# EAGLE design Memory (EAGLE 9.6.1)
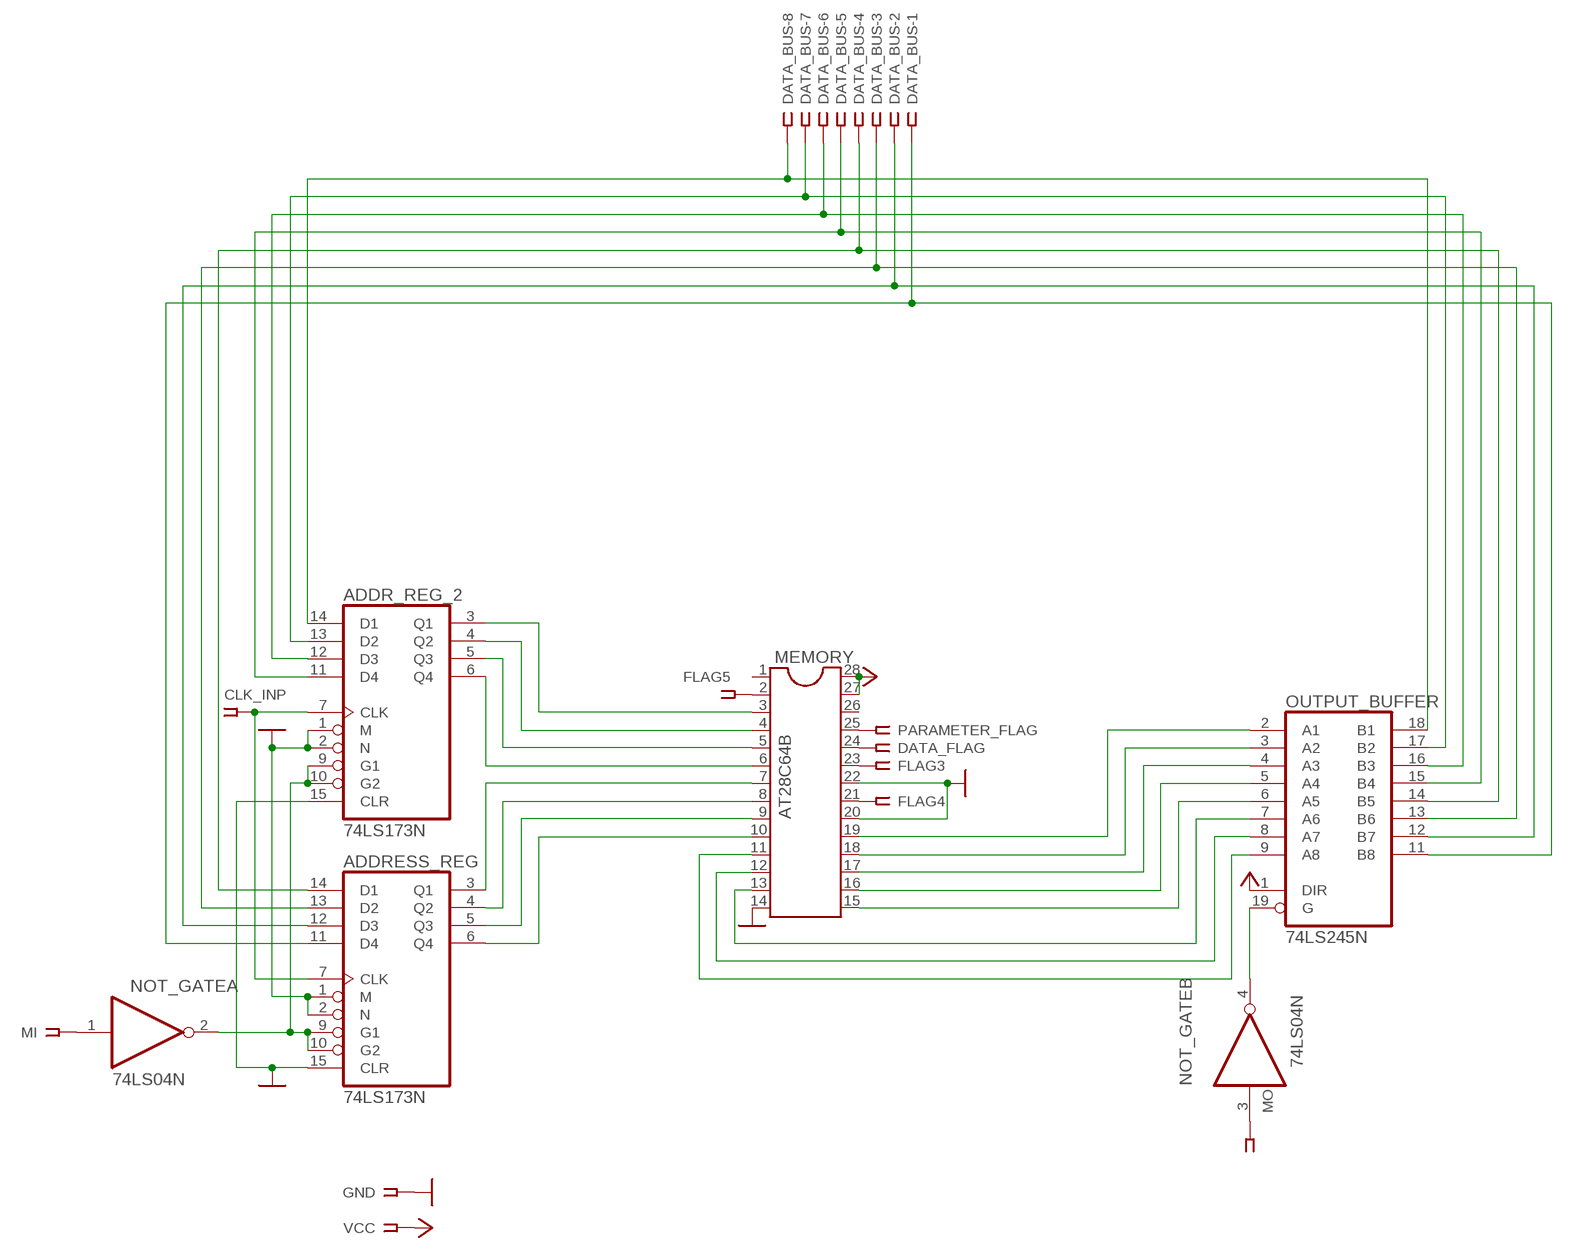
[diagram p0: schematic, sheet 1]

## Parts
ADDR_REG_2  74LS173N  [DIL16]
ADDRESS_REG  74LS173N  [DIL16]
CLK_INP  SSW-101-02-G-S-RA  [SSW-101-02-G-S-RA]
DATA_BUS  SSW-108-02-G-S  [SSW-108-02-G-S]
DATA_FLAG  SSW-101-02-G-S-RA  [SSW-101-02-G-S-RA]
FLAG3  SSW-101-02-G-S-RA  [SSW-101-02-G-S-RA]
FLAG4  SSW-101-02-G-S-RA  [SSW-101-02-G-S-RA]
FLAG5  SSW-101-02-G-S-RA  [SSW-101-02-G-S-RA]
GND  SSW-101-02-G-S-RA  [SSW-101-02-G-S-RA]
MEMORY  AT28C64B  DIL28  [DIL28-6]
MI  SSW-101-02-G-S-RA  [SSW-101-02-G-S-RA]
MO  SSW-101-02-G-S-RA  [SSW-101-02-G-S-RA]
NOT_GATE  74LS04N  [DIL14]
OUTPUT_BUFFER  74LS245N  [DIL20]
PARAMETER_FLAG  SSW-101-02-G-S-RA  [SSW-101-02-G-S-RA]
VCC  SSW-101-02-G-S-RA  [SSW-101-02-G-S-RA]

## Nets
GND: ADDR_REG_2.1(M) ADDR_REG_2.2(N) ADDR_REG_2.15(CLR) ADDRESS_REG.1(M) ADDRESS_REG.2(N) ADDRESS_REG.15(CLR) GND.1 MEMORY.14 MEMORY.20 MEMORY.22
N$1: ADDR_REG_2.7(CLK) ADDRESS_REG.7(CLK) CLK_INP.1
N$2: ADDR_REG_2.9(G1) ADDR_REG_2.10(G2) ADDRESS_REG.9(G1) ADDRESS_REG.10(G2) NOT_GATE.2(A:O)
N$3: MI.1 NOT_GATE.1(A:I)
N$4: ADDRESS_REG.6(Q4) MEMORY.10
N$5: ADDRESS_REG.5(Q3) MEMORY.9
N$6: ADDRESS_REG.4(Q2) MEMORY.8
N$7: ADDRESS_REG.3(Q1) MEMORY.7
N$8: ADDR_REG_2.6(Q4) MEMORY.6
N$9: FLAG5.1 MEMORY.2
N$10: FLAG3.1 MEMORY.23
N$11: DATA_FLAG.1 MEMORY.24
N$12: MEMORY.25 PARAMETER_FLAG.1
N$13: FLAG4.1 MEMORY.21
N$14: ADDR_REG_2.5(Q3) MEMORY.5
N$15: ADDR_REG_2.4(Q2) MEMORY.4
N$16: ADDR_REG_2.3(Q1) MEMORY.3
N$17: MEMORY.13 OUTPUT_BUFFER.7(A6)
N$18: MEMORY.12 OUTPUT_BUFFER.8(A7)
N$19: MEMORY.11 OUTPUT_BUFFER.9(A8)
N$20: MEMORY.15 OUTPUT_BUFFER.6(A5)
N$21: MEMORY.16 OUTPUT_BUFFER.5(A4)
N$22: MEMORY.17 OUTPUT_BUFFER.4(A3)
N$23: MEMORY.18 OUTPUT_BUFFER.3(A2)
N$24: MEMORY.19 OUTPUT_BUFFER.2(A1)
N$25: MO.1 NOT_GATE.3(B:I)
N$26: NOT_GATE.4(B:O) OUTPUT_BUFFER.19(G)
N$35: ADDR_REG_2.14(D1) DATA_BUS.8 OUTPUT_BUFFER.18(B1)
N$36: ADDR_REG_2.13(D2) DATA_BUS.7 OUTPUT_BUFFER.17(B2)
N$37: ADDR_REG_2.12(D3) DATA_BUS.6 OUTPUT_BUFFER.16(B3)
N$38: ADDR_REG_2.11(D4) DATA_BUS.5 OUTPUT_BUFFER.15(B4)
N$39: ADDRESS_REG.14(D1) DATA_BUS.4 OUTPUT_BUFFER.14(B5)
N$40: ADDRESS_REG.13(D2) DATA_BUS.3 OUTPUT_BUFFER.13(B6)
N$41: ADDRESS_REG.12(D3) DATA_BUS.2 OUTPUT_BUFFER.12(B7)
N$42: ADDRESS_REG.11(D4) DATA_BUS.1 OUTPUT_BUFFER.11(B8)
VCC: MEMORY.27 MEMORY.28 OUTPUT_BUFFER.1(DIR) VCC.1
Unconnected: MEMORY.1 MEMORY.26 NOT_GATE.5(C:I) NOT_GATE.6(C:O) NOT_GATE.8(D:O) NOT_GATE.9(D:I) NOT_GATE.10(E:O) NOT_GATE.11(E:I) NOT_GATE.12(F:O) NOT_GATE.13(F:I)

## Power pins joined to a net without a drawn wire
GND: ADDR_REG_2.8(GND) ADDRESS_REG.8(GND) NOT_GATE.7(P:GND) OUTPUT_BUFFER.10(GND)
VCC: ADDR_REG_2.16(VCC) ADDRESS_REG.16(VCC) NOT_GATE.14(P:VCC) OUTPUT_BUFFER.20(VCC)

## Library data of the parts
ADDR_REG_2 ADDRESS_REG = 74xx-eu:74*173: 4-bit D type REGISTER, 3-state
CLK_INP DATA_FLAG FLAG3-FLAG5 GND MI MO PARAMETER_FLAG VCC = con-samtec:SSW-101-02-G-S: THROUGH-HOLE .025" SQ POST SOCKET Source: Samtec SSW.pdf; MF: Samtec Inc.; MPN: SSW-101-02-G-S-RA; OC_FARNELL: unknown; OC_NEWARK: 11P9337
DATA_BUS = con-samtec:SSW-108-02-G-S: THROUGH-HOLE .025" SQ POST SOCKET Source: Samtec SSW.pdf; MF: Samtec Inc.; MPN: SSW-108-02-G-S; OC_FARNELL: unknown; OC_NEWARK: 11P9448
MEMORY = ic-package:DIL28: Dual In Line
NOT_GATE = 74xx-eu:74*04: Hex INVERTER
OUTPUT_BUFFER = 74xx-eu:74*245: Octal BUS TRANSCEIVER, 3-state

## Board
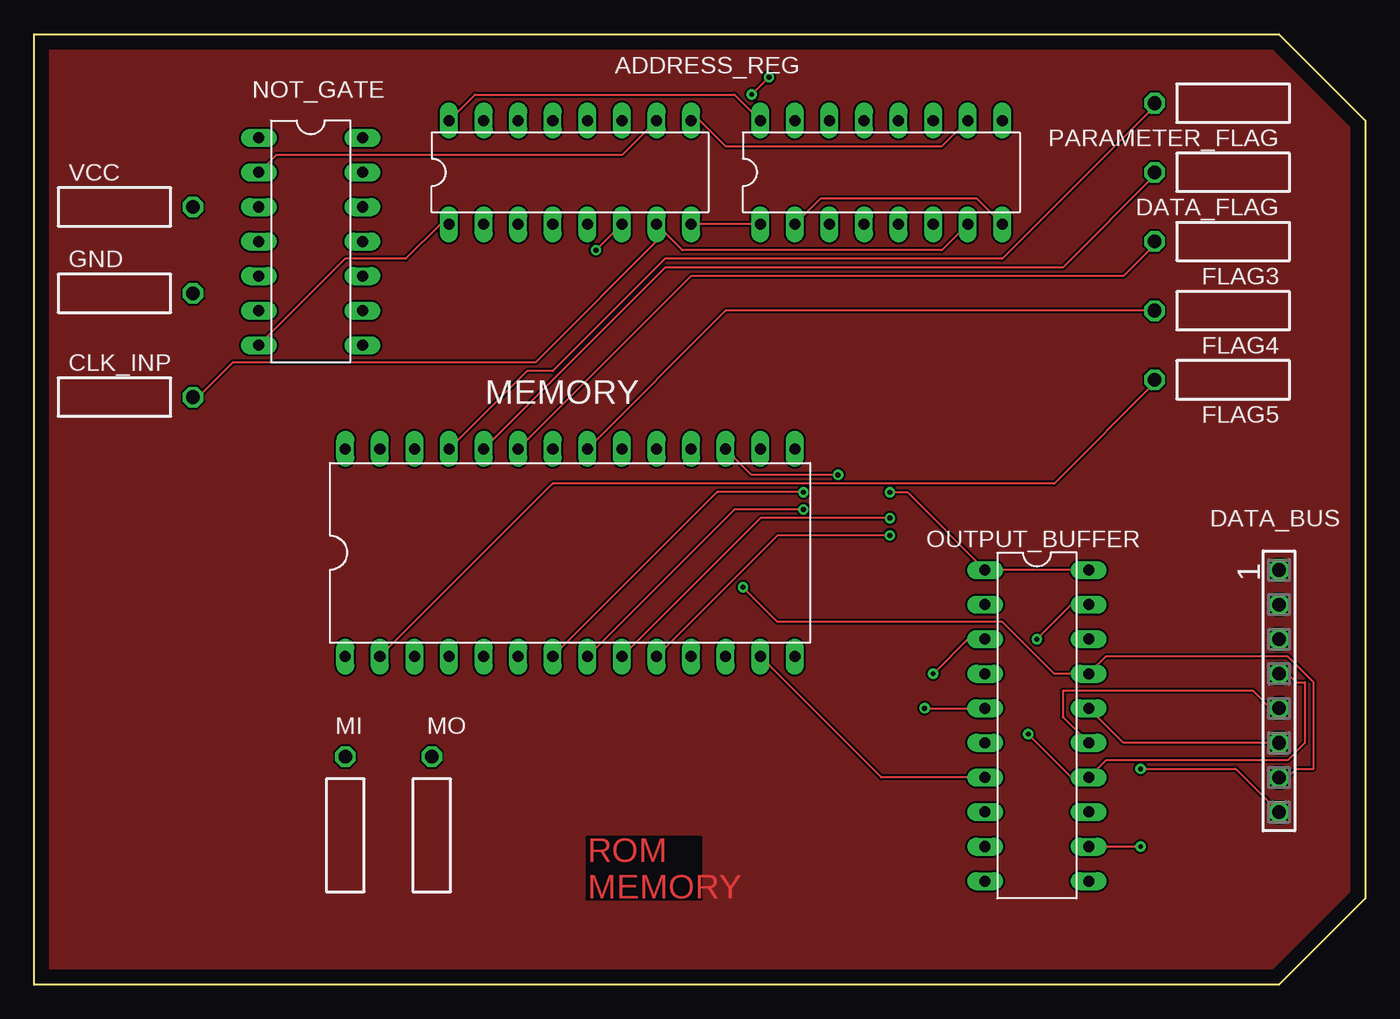
[diagram p1: board, top side]
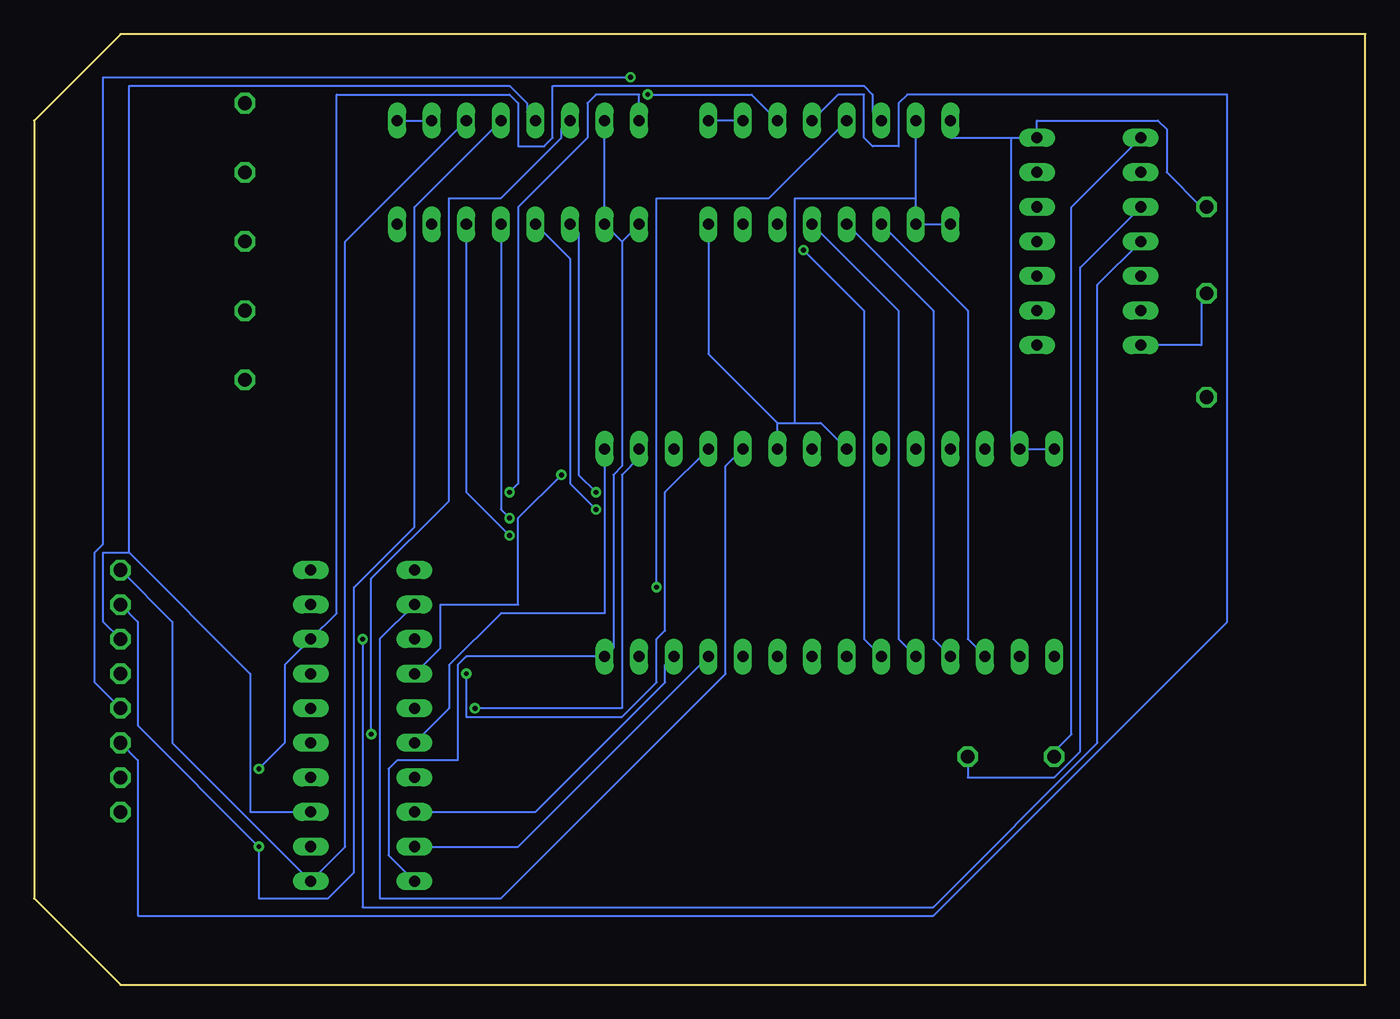
[diagram p2: board, bottom side, seen from below]

Size 97.79 x 69.85 mm. Coordinates in mm from the lower left corner, seen from the top.
Outline: 0,69.85 91.44,69.85 97.79,63.5 97.79,6.35 91.44,0 0,0 0,69.85
Copper layers (1*16): Top 0.035mm / dielectric 1.5mm / Bottom 0.035mm
Design rules "default": minimum track width 6mil, minimum drill 0.35mm, track to track 6mil, track to pad 6mil, pad to pad 6mil, via to via 6mil, smd to smd 6mil, copper to edge 40mil, drill to drill 6mil, minimum pad ring 10mil, minimum via ring 8mil, stop-mask expansion 4mil, vias tented up to drill 0mil, thermal gap 10mil

### Footprints (pad centres in the part's own frame; a part is rotated, then mirrored left to right if it is on the bottom)
DIL16 = drill 0.813 long: 1 -8.89,-3.81; 2 -6.35,-3.81; 3 -3.81,-3.81; 4 -1.27,-3.81; 5 1.27,-3.81; 6 3.81,-3.81; 7 6.35,-3.81; 8 8.89,-3.81; 9 8.89,3.81; 10 6.35,3.81; 11 3.81,3.81; 12 1.27,3.81; 13 -1.27,3.81; 14 -3.81,3.81; 15 -6.35,3.81; 16 -8.89,3.81
SSW-101-02-G-S-RA = drill 1 pad 1.5 octagon: 1 0,1.524
SSW-108-02-G-S = drill 1 pad 1.5 octagon: 1 -8.89,0; 2 -6.35,0; 3 -3.81,0; 4 -1.27,0; 5 1.27,0; 6 3.81,0; 7 6.35,0; 8 8.89,0
DIL28-6 = drill 0.813 long: 1 -16.51,-7.62; 2 -13.97,-7.62; 3 -11.43,-7.62; 4 -8.89,-7.62; 5 -6.35,-7.62; 6 -3.81,-7.62; 7 -1.27,-7.62; 8 1.27,-7.62; 9 3.81,-7.62; 10 6.35,-7.62; 11 8.89,-7.62; 12 11.43,-7.62; 13 13.97,-7.62; 14 16.51,-7.62; 15 16.51,7.62; 16 13.97,7.62; 17 11.43,7.62; 18 8.89,7.62; 19 6.35,7.62; 20 3.81,7.62; 21 1.27,7.62; 22 -1.27,7.62; 23 -3.81,7.62; 24 -6.35,7.62; 25 -8.89,7.62; 26 -11.43,7.62; 27 -13.97,7.62; 28 -16.51,7.62
DIL14 = drill 0.813 long: 1 -7.62,-3.81; 2 -5.08,-3.81; 3 -2.54,-3.81; 4 0,-3.81; 5 2.54,-3.81; 6 5.08,-3.81; 7 7.62,-3.81; 8 7.62,3.81; 9 5.08,3.81; 10 2.54,3.81; 11 0,3.81; 12 -2.54,3.81; 13 -5.08,3.81; 14 -7.62,3.81
DIL20 = drill 0.813 long: 1 -11.43,-3.81; 2 -8.89,-3.81; 3 -6.35,-3.81; 4 -3.81,-3.81; 5 -1.27,-3.81; 6 1.27,-3.81; 7 3.81,-3.81; 8 6.35,-3.81; 9 8.89,-3.81; 10 11.43,-3.81; 11 11.43,3.81; 12 8.89,3.81; 13 6.35,3.81; 14 3.81,3.81; 15 1.27,3.81; 16 -1.27,3.81; 17 -3.81,3.81; 18 -6.35,3.81; 19 -8.89,3.81; 20 -11.43,3.81

### Placement (x,y rotation side)
ADDR_REG_2  39.37,59.69 0 top
ADDRESS_REG  62.23,59.69 0 top
CLK_INP  10.16,43.18 270 top
DATA_BUS  91.44,21.59 270 top
DATA_FLAG  83.82,59.69 90 top
FLAG3  83.82,54.61 90 top
FLAG4  83.82,49.53 90 top
FLAG5  83.82,44.45 90 top
GND  10.16,50.8 270 top
MEMORY  39.37,31.75 0 top
MI  22.86,15.24 0 top
MO  29.21,15.24 0 top
NOT_GATE  20.32,54.61 270 top
OUTPUT_BUFFER  73.66,19.05 270 top
PARAMETER_FLAG  83.82,64.77 90 top
VCC  10.16,57.15 270 top

### Tracks (layer width: path | path; a pad name or v marks a point on that pad's centre or on a via)
GND
  Top 0.152: NOT_GATE.7 22.86,53.34 27.3,53.34 29.84,55.88 ADDR_REG_2.1 | ADDRESS_REG.1 ADDR_REG_2.8 | ADDRESS_REG.8 69.22,57.79 57.78,57.79 ADDRESS_REG.2
  Bottom 0.152: NOT_GATE.7 12.06,46.99 12.06,50.8 GND.1 | ADDR_REG_2.1 ADDR_REG_2.2 33.02,57.79 | 33.02,57.79 ADDR_REG_2.15 | MEMORY.22 40.01,41.28 41.91,41.28 | 43.18,41.28 41.91,41.28 | MEMORY.20 43.18,41.28 | 54.61,54.61 54.61,38.1 55.24,37.47 55.24,24.76 MEMORY.14 66.04,24.13 66.67,23.49 66.67,16.51 71.12,16.51 71.75,15.88 71.75,9.52 OUTPUT_BUFFER.10 | ADDRESS_REG.1 54.61,54.61 | 54.61,54.61 ADDRESS_REG.2 ADDRESS_REG.15 | 43.18,41.28 48.26,46.36 ADDR_REG_2.8 | 33.02,57.79 41.91,57.79 41.91,41.28
MAIN
  pour Top: 0,69.85 91.44,69.85 97.79,63.5 97.79,6.35 91.44,0 0,0
N$1
  Top 0.152: 46.35,55.25 47.62,53.98 66.67,53.98 ADDRESS_REG.7 | 46.35,55.25 36.83,45.72 14.61,45.72 12.06,43.18 CLK_INP.1 | 46.35,55.25 ADDR_REG_2.7
N$2
  Top 0.152: NOT_GATE.2 17.78,60.96 43.18,60.96 ADDR_REG_2.10 | ADDRESS_REG.10 66.67,61.6 50.8,61.6 48.9,63.5 ADDR_REG_2.9
  Bottom 0.152: ADDRESS_REG.9 ADDRESS_REG.10 | ADDR_REG_2.10 ADDR_REG_2.9
N$3
  Bottom 0.152: NOT_GATE.1 21.59,57.15 21.59,18.41 22.86,17.14 MI.1
N$4  (via drill 0.35)
  Top 0.152: MEMORY.10 54.61,33.02 v62.87,33.02
  Bottom 0.152: v62.87,33.02 66.04,36.2 ADDRESS_REG.6
N$5  (via drill 0.35)
  Top 0.152: MEMORY.9 53.34,34.29 v62.87,34.29
  Bottom 0.152: v62.87,34.29 63.5,34.93 ADDRESS_REG.5
N$6  (via drill 0.35)
  Top 0.152: MEMORY.8 51.44,34.93 v56.52,34.93
  Bottom 0.152: v56.52,34.93 58.42,36.83 58.42,53.34 ADDRESS_REG.4
N$7  (via drill 0.35)
  Top 0.152: MEMORY.7 50.16,36.2 v56.52,36.2
  Bottom 0.152: v56.52,36.2 57.78,37.47 57.78,55.25 ADDRESS_REG.3
N$8  (via drill 0.35)
  Top 0.152: ADDR_REG_2.6 v41.27,53.98
  Bottom 0.152: MEMORY.6 36.83,25.4 36.83,49.53 v41.27,53.98
N$9
  Top 0.152: MEMORY.2 38.1,36.83 74.93,36.83 82.55,44.45 FLAG5.1
N$10
  Top 0.152: MEMORY.23 48.26,52.07 80.01,52.07 82.55,54.61 FLAG3.1
N$11
  Top 0.152: MEMORY.24 46.35,52.71 75.56,52.71 82.55,59.69 DATA_FLAG.1
N$12
  Top 0.152: MEMORY.25 36.2,45.09 38.1,45.09 46.35,53.34 71.12,53.34 82.55,64.77 PARAMETER_FLAG.1
N$13
  Top 0.152: MEMORY.21 50.8,49.53 FLAG4.1
N$14
  Bottom 0.152: MEMORY.5 34.29,25.4 34.29,49.53 ADDR_REG_2.5
N$15
  Bottom 0.152: MEMORY.4 31.75,25.4 31.75,49.53 ADDR_REG_2.4
N$16
  Bottom 0.152: MEMORY.3 29.21,25.4 29.21,49.53 ADDR_REG_2.3
N$17
  Top 0.152: MEMORY.13 62.23,15.24 OUTPUT_BUFFER.7
N$18
  Bottom 0.152: MEMORY.12 51.44,23.49 51.44,22.22 60.96,12.7 OUTPUT_BUFFER.8
N$19
  Bottom 0.152: MEMORY.11 62.23,10.16 OUTPUT_BUFFER.9
N$20
  Bottom 0.152: OUTPUT_BUFFER.6 67.31,20.32 67.31,23.49 63.5,27.3 55.88,27.3 MEMORY.15
N$21  (via drill 0.35)
  Top 0.152: v65.41,20.32 OUTPUT_BUFFER.5
  Bottom 0.152: v65.41,20.32 54.61,20.32 54.61,37.47 53.34,38.73 MEMORY.16
N$22  (via drill 0.35)
  Top 0.152: MEMORY.17 52.7,37.47 v59.05,37.47
  Bottom 0.152: v59.05,37.47 62.23,34.29 62.23,27.94 67.94,27.94 67.94,24.76 OUTPUT_BUFFER.4
N$23  (via drill 0.35)
  Top 0.152: v66.04,22.86 68.58,25.4 OUTPUT_BUFFER.3
  Bottom 0.152: MEMORY.18 51.44,36.2 51.44,26.04 52.07,25.4 52.07,22.22 54.61,19.68 66.04,19.68 v66.04,22.86
N$24
  Bottom 0.152: MEMORY.19 46.99,38.1 46.99,22.86 63.5,6.35 72.39,6.35 72.39,25.4 OUTPUT_BUFFER.2
N$25
  Bottom 0.152: NOT_GATE.3 20.95,52.71 20.95,17.14 22.86,15.24 29.21,15.24 MO.1
N$26  (via drill 0.35)
  Top 0.152: v73.66,25.4 76.2,27.94 OUTPUT_BUFFER.19
  Bottom 0.152: NOT_GATE.4 19.68,51.44 19.68,17.78 31.75,5.72 73.66,5.72 v73.66,25.4
N$35  (via drill 0.35)
  Top 0.152: DATA_BUS.8 88.27,15.88 v81.28,15.88
  Bottom 0.152: ADDR_REG_2.14 36.2,64.13 36.2,65.41 36.83,66.04 59.69,66.04 59.69,62.23 60.33,61.6 62.23,61.6 62.23,64.77 62.87,65.41 75.56,65.41 75.56,27.3 OUTPUT_BUFFER.18 79.38,23.49 79.38,17.78 v81.28,15.88
N$36  (via drill 0.35)
  Top 0.152: DATA_BUS.7 92.08,15.24 92.71,15.88 93.98,15.88 93.98,22.22 92.08,24.13 78.74,24.13 OUTPUT_BUFFER.17 74.93,22.86 71.12,26.67 54.61,26.67 v52.07,29.21
  Bottom 0.152: ADDR_REG_2.13 43.81,57.79 52.07,57.79 v52.07,29.21
N$37
  Top 0.152: OUTPUT_BUFFER.16 80.01,17.78 DATA_BUS.6
  Bottom 0.152: ADDR_REG_2.12 38.73,65.41 36.83,65.41 36.83,62.23 36.2,61.6 34.29,61.6 34.29,64.77 33.66,65.41 10.16,65.41 10.16,26.67 31.75,5.08 90.17,5.08 90.17,16.51 DATA_BUS.6
N$38  (via drill 0.35)
  Top 0.152: OUTPUT_BUFFER.15 75.56,19.68 75.56,21.59 89.53,21.59 90.81,20.32 DATA_BUS.5 | v53.98,66.67 v52.7,65.41
  Bottom 0.152: ADDR_REG_2.11 45.09,65.41 v52.7,65.41 | v53.98,66.67 92.71,66.67 92.71,32.39 93.34,31.75 93.34,22.22 DATA_BUS.5
N$39  (via drill 0.35)
  Top 0.152: DATA_BUS.4 92.08,22.86 92.71,22.22 93.34,22.22 93.34,17.78 92.08,16.51 78.74,16.51 OUTPUT_BUFFER.14 76.2,15.24 v73.03,18.41
  Bottom 0.152: ADDRESS_REG.14 59.05,62.87 59.05,62.23 63.5,57.79 67.31,57.79 67.31,35.56 73.03,29.85 v73.03,18.41
N$40
  Bottom 0.152: OUTPUT_BUFFER.13 81.92,12.7 81.92,22.86 90.81,31.75 | 90.81,31.75 92.71,31.75 92.71,26.67 DATA_BUS.3 | ADDRESS_REG.13 61.59,64.13 61.59,64.77 62.87,66.04 90.81,66.04 90.81,31.75
N$41  (via drill 0.35)
  Top 0.152: v81.28,10.16 OUTPUT_BUFFER.12
  Bottom 0.152: DATA_BUS.2 90.17,26.67 90.17,19.05 v81.28,10.16 81.28,6.35 76.2,6.35 74.3,8.25 74.3,29.21 69.85,33.66 69.85,57.15 ADDRESS_REG.12
N$42
  Bottom 0.152: DATA_BUS.1 87.63,26.67 87.63,17.78 OUTPUT_BUFFER.11 74.93,10.16 74.93,54.61 ADDRESS_REG.11
VCC  (via drill 0.35)
  Top 0.152: OUTPUT_BUFFER.20 OUTPUT_BUFFER.1 64.14,36.2 v62.87,36.2 | ADDRESS_REG.16 51.44,65.41 32.38,65.41 ADDR_REG_2.16
  Bottom 0.152: MEMORY.28 MEMORY.27 26.04,40.01 26.04,62.23 | 26.04,62.23 30.48,62.23 ADDR_REG_2.16 | 26.04,62.23 NOT_GATE.14 24.13,63.5 15.24,63.5 14.61,62.87 14.61,59.69 12.06,57.15 VCC.1 | v62.87,36.2 62.23,36.83 62.23,57.15 57.15,62.23 57.15,64.77 56.52,65.41 53.34,65.41 ADDRESS_REG.16

### Text on the board
Top: ROM / MEMORY